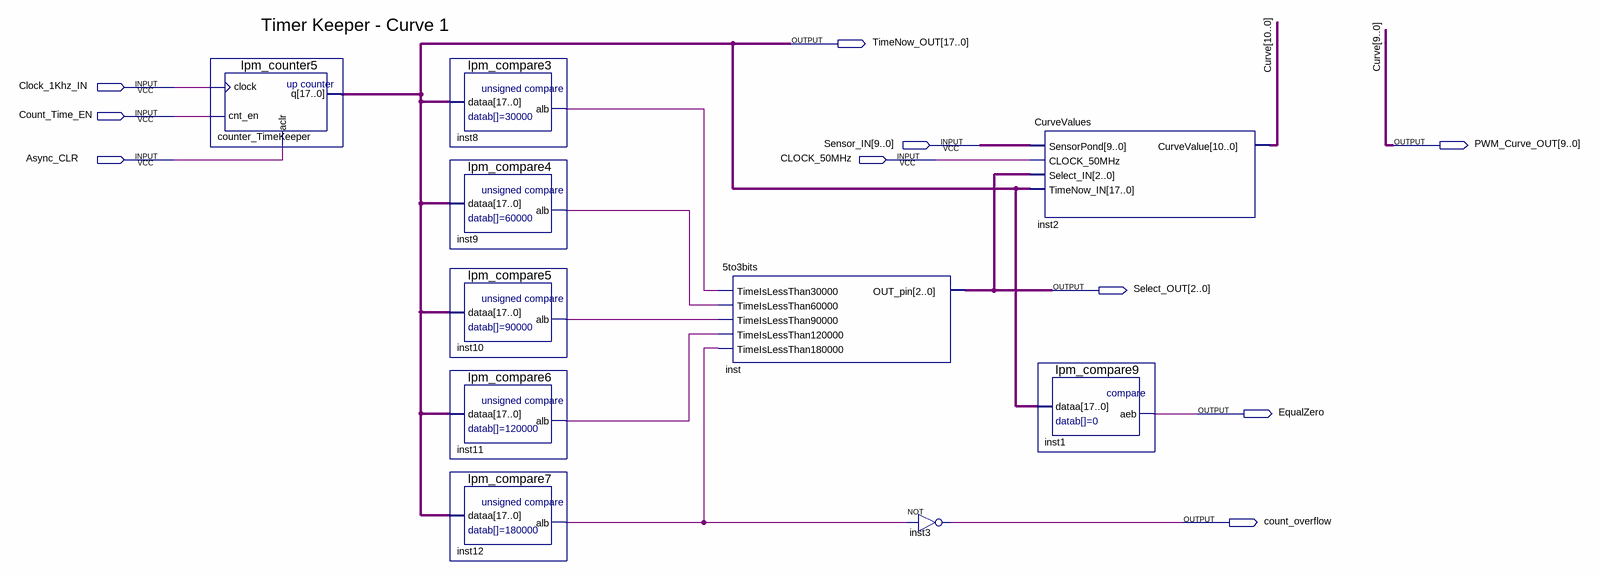
[diagram p0: schematic sheet]
// Quartus schematic TimerKeeperCurve1.bdf as structural Verilog: 10 symbols, 10 pins
module TimerKeeperCurve1 (
  input  Clock_1Khz_IN,
  input  Count_Time_EN,
  input  [9:0] Sensor_IN,
  input  Async_CLR,
  input  CLOCK_50MHz,
  output [17:0] TimeNow_OUT,
  output [9:0] PWM_Curve_OUT,
  output [2:0] Select_OUT,
  output EqualZero,
  output count_overflow
);

  wire inst8_alb, inst9_alb, inst10_alb, inst11_alb, inst12_alb;
  wire [10:10] Curve;

  lpm_counter5 counter_TimeKeeper (.clock(Clock_1Khz_IN), .cnt_en(Count_Time_EN), .aclr(Async_CLR), .q(TimeNow_OUT));
  lpm_compare3 inst8 (.dataa(TimeNow_OUT), .alb(inst8_alb));
  lpm_compare4 inst9 (.dataa(TimeNow_OUT), .alb(inst9_alb));
  lpm_compare5 inst10 (.dataa(TimeNow_OUT), .alb(inst10_alb));
  lpm_compare6 inst11 (.dataa(TimeNow_OUT), .alb(inst11_alb));
  lpm_compare7 inst12 (.dataa(TimeNow_OUT), .alb(inst12_alb));
  \5to3bits  inst (
    .TimeIsLessThan30000(inst8_alb), .TimeIsLessThan60000(inst9_alb), .TimeIsLessThan90000(inst10_alb),
    .TimeIsLessThan120000(inst11_alb), .TimeIsLessThan180000(inst12_alb), .OUT_pin(Select_OUT));
  not inst3 (count_overflow, inst12_alb);
  CurveValues inst2 (
    .SensorPond(Sensor_IN), .CLOCK_50MHz(CLOCK_50MHz), .Select_IN(Select_OUT), .TimeNow_IN(TimeNow_OUT),
    .CurveValue({Curve[10], PWM_Curve_OUT}));
  lpm_compare9 inst1 (.dataa(TimeNow_OUT), .aeb(EqualZero));

  // Other names for the same wires on the sheet: Curve[9:0] = PWM_Curve_OUT

  // Notes on the sheet:
  //   Timer Keeper - Curve 1
endmodule
